# EAGLE design Mergen Telemetri + Ateşleme (EAGLE 9.6.2)
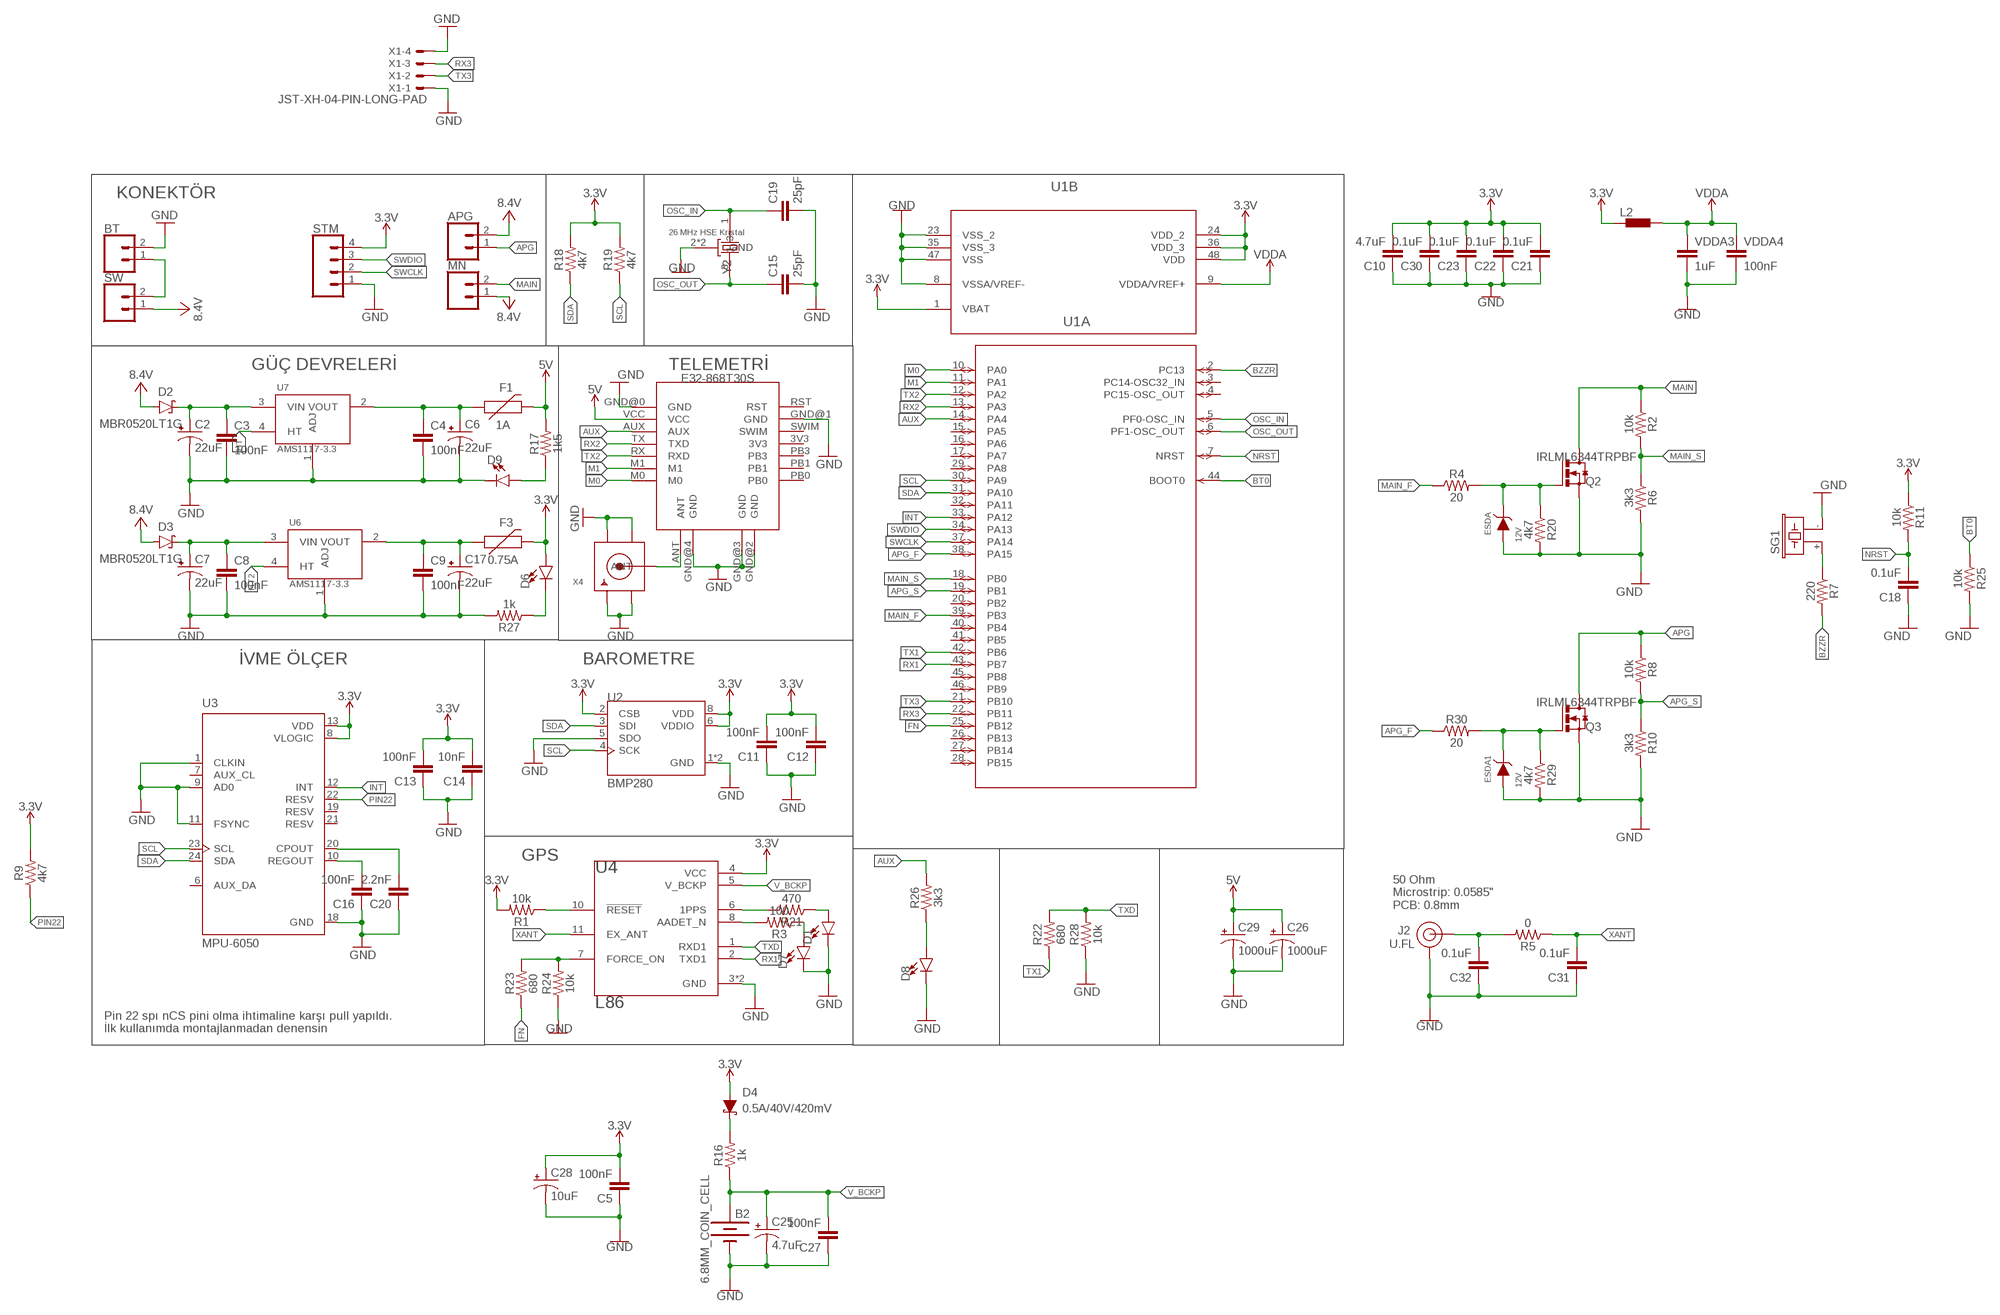
[diagram p0: schematic, sheet 1]

## Parts
APG  CONN_02POLAR  [MOLEX-1X2]
B2  6.8MM_COIN_CELL  BATTERY-6.8MM_SMD  [BATTCON-6.8MM]
BT  CONN_02POLAR  [MOLEX-1X2]
C2  22uF  47UF-POLAR-EIA3528-10V-10%  [EIA3528]
C3  100nF  1.0UF-0603-16V-10%  [0603]
C4  100nF  1.0UF-0603-16V-10%  [0603]
C5  100nF  1.0UF-0603-16V-10%  [0603]
C6  22uF  47UF-POLAR-EIA3528-10V-10%  [EIA3528]
C7  22uF  47UF-POLAR-EIA3528-10V-10%  [EIA3528]
C8  100nF  1.0UF-0603-16V-10%  [0603]
C9  100nF  1.0UF-0603-16V-10%  [0603]
C10  4.7uF  1.0UF-0603-16V-10%  [0603]
C11  100nF  1.0UF-0603-16V-10%  [0603]
C12  100nF  1.0UF-0603-16V-10%  [0603]
C13  100nF  1.0UF-0603-16V-10%  [0603]
C14  10nF  1.0UF-0603-16V-10%  [0603]
C15  25pF  1.0UF-0603-16V-10%  [0603]
C16  100nF  1.0UF-0603-16V-10%  [0603]
C17  22uF  47UF-POLAR-EIA3528-10V-10%  [EIA3528]
C18  0.1uF  1.0UF-0603-16V-10%  [0603]
C19  25pF  1.0UF-0603-16V-10%  [0603]
C20  2.2nF  1.0UF-0603-16V-10%  [0603]
C21  0.1uF  1.0UF-0603-16V-10%  [0603]
C22  0.1uF  1.0UF-0603-16V-10%  [0603]
C23  0.1uF  1.0UF-0603-16V-10%  [0603]
C25  4.7uF  47UF-POLAR-EIA3528-10V-10%  [EIA3528]
C26  1000uF  CPOL-US150CLZ-1010  [150CLZ-1010]
C27  100nF  1.0UF-0603-16V-10%  [0603]
C28  10uF  47UF-POLAR-EIA3528-10V-10%  [EIA3528]
C29  1000uF  CPOL-US150CLZ-1010  [150CLZ-1010]
C30  0.1uF  1.0UF-0603-16V-10%  [0603]
C31  0.1uF  1.0UF-0603-16V-10%  [0603]
C32  0.1uF  1.0UF-0603-16V-10%  [0603]
D1  LED0603  [LED-0603]
D2  MBR0520LT1G  SCHOTTKY_MBR0520LT1GDO-219  [SODFL3718X115]
D3  MBR0520LT1G  SCHOTTKY_MBR0520LT1GDO-219  [SODFL3718X115]
D4  0.5A/40V/420mV  DIODE-SCHOTTKY-PMEG4005EJ  [SOD-323]
D6  LED0603  [LED-0603]
D7  LED0603  [LED-0603]
D8  LED0603  [LED-0603]
D9  LED0603  [LED-0603]
ESDA  12V  WE-TVSP_DO-214AC_400W_UNI_824500102  [WE-TVSP_DO-214AC_UNIDIRECTIONAL]
ESDA1  12V  WE-TVSP_DO-214AC_400W_UNI_824500102  [WE-TVSP_DO-214AC_UNIDIRECTIONAL]
F1  1A  PPTC_HALF-AMP  [1206]
F3  0.75A  PPTC_HALF-AMP  [1206]
J2  U.FL  U.FL2PIN  [U.FL]
L2  BLM15HB221SN1  [0402]
MN  CONN_02POLAR  [MOLEX-1X2]
Q2  IRLML6344TRPBF  [SOT23]
Q3  IRLML6344TRPBF  [SOT23]
R1  10k  1KOHM-0603-1/10W-1%  [0603]
R2  10k  1KOHM-0603-1/10W-1%  [0603]
R3  100  1KOHM-0603-1/10W-1%  [0603]
R4  20  1KOHM-0603-1/10W-1%  [0603]
R5  0  1KOHM-0603-1/10W-1%  [0603]
R6  3k3  1KOHM-0603-1/10W-1%  [0603]
R7  220  1KOHM-0603-1/10W-1%  [0603]
R8  10k  1KOHM-0603-1/10W-1%  [0603]
R9  4k7  1KOHM-0603-1/10W-1%  [0603]
R10  3k3  1KOHM-0603-1/10W-1%  [0603]
R11  10k  1KOHM-0603-1/10W-1%  [0603]
R16  1k  1KOHM-0603-1/10W-1%  [0603]
R17  1k5  1KOHM-0603-1/10W-1%  [0603]
R18  4k7  1KOHM-0603-1/10W-1%  [0603]
R19  4k7  1KOHM-0603-1/10W-1%  [0603]
R20  4k7  1KOHM-0603-1/10W-1%  [0603]
R21  470  1KOHM-0603-1/10W-1%  [0603]
R22  680  1KOHM-0603-1/10W-1%  [0603]
R23  680  1KOHM-0603-1/10W-1%  [0603]
R24  10k  1KOHM-0603-1/10W-1%  [0603]
R25  10k  1KOHM-0603-1/10W-1%  [0603]
R26  3k3  1KOHM-0603-1/10W-1%  [0603]
R27  1k  1KOHM-0603-1/10W-1%  [0603]
R28  10k  1KOHM-0603-1/10W-1%  [0603]
R29  4k7  1KOHM-0603-1/10W-1%  [0603]
R30  20  1KOHM-0603-1/10W-1%  [0603]
SG1  F/CM12P  [F/CM12P]
STM  CONN_04  [1X04]
SW  CONN_02POLAR  [MOLEX-1X2]
U1  STM32F303CCT6  [LQFP48-7X7MM]
U2  BMP280  [XDCR_BMP280]
U3  MPU-6050  [QFN50P400X400X95-24N]
U4  L86  [XCVR_L86]
U5  E32-868T30S  [E32-868T30S]
U6  AMS1117-3.3  [SOT229P700X180-4N]
U7  AMS1117-3.3  [SOT229P700X180-4N]
VDDA3  1uF  0.1UF-0603-25V-(+80/-20%)  [0603]
VDDA4  100nF  0.1UF-0603-25V-(+80/-20%)  [0603]
X1  JST-XH-04-PIN-LONG-PAD  [JST-XH-04-PACKAGE-LONG-PAD]
X4  SMACONNECTOR  [SMA90_DIP]
Y2  ABM3B-26.000MHZ-10-1-U-T  [OSCCC500X320X110-4N]

## Nets
3.3V: C5.2 C10.2 C11.2 C12.2 C13.2 C14.2 C21.2 C22.2 C23.2 C28.A(+) C30.2 D4.A D6.A F3.2 L2.1 R1.2 R9.2 R11.1 R18.2 R19.2 STM.4 U1.1(B:VBAT) U1.24(B:VDD_2) U1.36(B:VDD_3) U1.48(B:VDD) U2.2(CSB) U2.6(VDDIO) U2.8(VDD) U3.8(VLOGIC) U3.13(VDD) U4.4(VCC)
5V: C26.+ C29.+ F1.2 R17.2 U5.VCC
APG: APG.1 Q3.3(D) R8.1
APG_F: R30.1 U1.38(A:PA15)
APG_S: R8.2 R10.1 U1.19(A:PB1)
AUX: R26.2 U1.14(A:PA4) U5.AUX
BT0: R25.1 U1.44(A:BOOT0)
BZZR: R7.2 U1.2(A:PC13)
FN: R23.1 U1.25(A:PB12)
GND: B2.- BT.2 C2.C(-) C3.2 C4.2 C5.1 C6.C(-) C7.C(-) C8.2 C9.2 C10.1 C11.1 C12.1 C13.1 C14.1 C15.2 C16.1 C17.C(-) C18.1 C19.2 C20.1 C21.1 C22.1 C23.1 C25.C(-) C26.- C27.1 C28.C(-) C29.- C30.1 C31.1 C32.1 D1.C D7.C D8.C D9.C ESDA1.2(A) ESDA.2(A) J2.1(GND) J2.2(GND) Q2.2(S) Q3.2(S) R6.2 R10.2 R20.2 R24.1 R25.2 R27.2 R28.1 R29.2 SG1.- STM.1 U1.8(B:VSSA/VREF-) U1.23(B:VSS_2) U1.35(B:VSS_3) U1.47(B:VSS) U2.1(GND) U2.5(SDO) U2.7(GND) U3.1(CLKIN) U3.9(AD0) U3.11(FSYNC) U3.18(GND) U4.3(GND) U4.12(GND) U5.GND@0(GND) U5.GND@1(GND) U5.GND@2(GND) U5.GND@3(GND) U5.GND@4(GND) U6.1(ADJ) U7.1(ADJ) VDDA3.2 VDDA4.2 X1.1 X1.4 X4.GND1 X4.GND2 X4.GND3 X4.GND4 Y2.2(GND) Y2.4(GND)
HT: U7.4(HT)
HT2: U6.4(HT)
INT: U1.33(A:PA12) U3.12(INT)
M0: U1.10(A:PA0) U5.M0
M1: U1.11(A:PA1) U5.M1
MAIN: MN.2 Q2.3(D) R2.1
MAIN_F: R4.1 U1.39(A:PB3)
MAIN_S: R2.2 R6.1 U1.18(A:PB0)
N$1: C2.A(+) C3.1 D2.1(C) U7.3(VIN)
N$2: C7.A(+) C8.1 D3.1(C) U6.3(VIN)
N$3: R1.1 U4.10(!RESET)
N$4: C4.1 C6.A(+) F1.1 U7.2(VOUT)
N$5: C9.1 C17.A(+) F3.1 U6.2(VOUT)
N$6: ESDA1.1(C) Q3.1(G) R29.1 R30.2
N$7: U5.ANT X4.ANTENNA(ANT)
N$8: R7.1 SG1.+
N$9: BT.1 SW.2
N$10: R21.2 U4.6(1PPS)
N$11: D1.A R21.1
N$12: D4.C R16.2
N$13: ESDA.1(C) Q2.1(G) R4.2 R20.1
N$14: D9.A R17.1
N$15: D6.C R27.1
N$16: R3.2 U4.8(AADET_N)
N$17: D7.A R3.1
N$18: C16.2 U3.10(REGOUT)
N$19: C32.2 J2.FEED(SIGNAL) R5.2
N$20: R23.2 R24.2 U4.7(FORCE_ON)
N$21: D8.A R26.1
N$22: C20.2 U3.20(CPOUT)
NRST: C18.2 R11.2 U1.7(A:NRST)
OSC_IN: C19.1 U1.5(A:PF0-OSC_IN) Y2.1
OSC_OUT: C15.1 U1.6(A:PF1-OSC_OUT) Y2.3
PIN22: R9.1 U3.22(RESV)
RX1: U1.43(A:PB7) U4.2(TXD1)
RX2: U1.13(A:PA3) U5.TX(TXD)
RX3: U1.22(A:PB11) X1.3
SCL: R19.1 U1.30(A:PA9) U2.4(SCK) U3.23(SCL)
SDA: R18.1 U1.31(A:PA10) U2.3(SDI) U3.24(SDA)
SWCLK: STM.2 U1.37(A:PA14)
SWDIO: STM.3 U1.34(A:PA13)
TX1: R22.1 U1.42(A:PB6)
TX2: U1.12(A:PA2) U5.RX(RXD)
TX3: U1.21(A:PB10) X1.2
TXD: R22.2 R28.2 U4.1(RXD1)
V_BCKP: B2.+ C25.A(+) C27.2 R16.1 U4.5(V_BCKP)
VCC: APG.2 D2.2(A) D3.2(A) MN.1 SW.1 ; supply symbol labelled 8.4V
VDDA: L2.2 U1.9(B:VDDA/VREF+) VDDA3.1 VDDA4.1
XANT: C31.2 R5.1 U4.11(EX_ANT)
Unconnected: U1.3(A:PC14-OSC32_IN) U1.4(A:PC15-OSC_OUT) U1.15(A:PA5) U1.16(A:PA6) U1.17(A:PA7) U1.20(A:PB2) U1.26(A:PB13) U1.27(A:PB14) U1.28(A:PB15) U1.29(A:PA8) U1.32(A:PA11) U1.40(A:PB4) U1.41(A:PB5) U1.45(A:PB8) U1.46(A:PB9) U3.6(AUX_DA) U3.7(AUX_CL) U3.19(RESV) U3.21(RESV) U5.3V3 U5.PB0 U5.PB1 U5.PB3 U5.RST U5.SWIM

## Notes on the sheet
- KONEKTÖR
- 26 MHz HSE Kristal
- GÜÇ DEVRELERİ | TELEMETRİ
- İVME ÖLÇER | BAROMETRE
- GPS
- 50 Ohm 
  Microstrip: 0.0585"
  PCB: 0.8mm
- Pin 22 spı nCS pini olma ihtimaline karşı pull yapıldı. 
  İlk kullanımda montajlanmadan denensin

## Library data of the parts
APG BT MN SW = SparkFun-Connectors:CONN_02: Multi connection point. Often used as Generic Header-pin footprint for 0.1 inch spaced/style header connections On any of the 0.1 inch spaced packages, you can populate with these: Break Away Headers - Straight <https://www.sparkfun.com/products/116> (PRT-00116) Break Away Male Headers - Right Angle <https://www.sparkfun.com/products/553> (PRT-00553) Female Headers <https://www.sparkfun.com/products/115> (PRT-00115) Break Away Headers - Machine Pin <https://www.sparkfun.com/products/117> (PRT-00117) Break Away Female Headers - Swiss Machine Pin <https://www.sparkfun.com/products/743> (PRT-00743) For SCREWTERMINALS and SPRING TERMINALS visit here: Screw Terimnals on SparkFun.com <https://www.sparkfun.com/search/results?term=Screw+Terminals> (5mm/3.5mm/2.54mm spacing) This device is also useful as a general connection point to wire up your design to another part of your project. Our various solder wires solder well into these plated through hole pads. Hook-Up Wire - Assortment (Stranded, 22 AWG) <https://www.sparkfun.com/products/11375> (PRT-11375) Hook-Up Wire - Assortment (Solid Core, 22 AWG) <https://www.sparkfun.com/products/11367> (PRT-11367) View the entire wire category on our website here <https://www.sparkfun.com/categories/141> Special notes: Molex polarized connector foot print use with: PRT-08233 with associated crimp pins and housings. 2.54_SCREWTERM for use with PRT-10571. 3.5mm Screw Terminal footprints for PRT-08084 5mm Screw Terminal footprints for use with PRT-08432; SF_ID: PRT-09918
B2 = SparkFun-Batteries:BATTERY: Battery - Single Cell A variety of battery chemistries, sizes, and footprints. Device List: 20MM_PTH - Coin Cell Battery Holder - 20mm (PTH) <https://www.sparkfun.com/products/783> 6.8MM_PTH - Coin Cell Battery Holder - 6.8MM(SMD) <https://www.digikey.com/product-detail/en/seiko-instruments/MS621FE-FL11E/728-1057-ND/1889208?WT.srch=1&gclid=CNOQ5a6LzdQCFZS2wAodXCkE0g> 12MM_SMD - Coin Cell Battery Holder - 12mm (SMD) <https://www.sparkfun.com/products/10592> 12MM_PTH - Coin Cell Battery Holder - 12mm (PTH) <https://www.sparkfun.com/products/7948> 20MM_SMD - 20mm Coin Cell Battery Holder (SMD) (2 legs) Used on the Big Time Watch Kit <https://www.sparkfun.com/products/11734> 20MM_SMD_4LEGS - Coin Cell Battery Holder - 20mm (SMD) <https://www.sparkfun.com/products/11892> 20MM_SMD_4LEGS_OVERPASTE - Coin Cell Battery Holder - 20mm (SMD) <https://www.sparkfun.com/products/11892> (Over-paste on the legs) 24.5MM_PTH - Coin Cell Battery Holder - 24.5mm (PTH) <https://www.sparkfun.com/products/8863> 9V - 9V Battery Holder - PC Mount Used on the SparkFun SparkPunk Sound Kit <https://www.sparkfun.com/products/11177> and SparkFun SparkPunk Sequencer Kit <https://www.sparkfun.com/products/12707> 18650 - Battery Holder - 18650 (PTH) <https://www.sparkfun.com/products/13113> AA - Battery Holder - 1xAA (PTH) <https://www.sparkfun.com/products/7949> AAA - Battery Holder - 1xAAA (PTH) <https://www.sparkfun.com/products/12718> AA_KIT - Battery Holder - 1xAA (PTH) <https://www.sparkfun.com/products/7949> Special kit package - pads only have exposed copper on one side of the board. AAA_KIT - Battery Holder - 1xAAA (PTH) <https://www.sparkfun.com/products/12718> Special kit package - pads only have exposed copper on one side of the board.; PROD_ID: BATT-13734
C2 C6 C7 C17 C25 C28 = SparkFun-Capacitors:47UF-POLAR: 47µF polarized capacitors A capacitor is a passive two-terminal electrical component used to store electrical energy temporarily in an electric field.; PROD_ID: CAP-08310; VALUE: 47uF
C3-C5 C8-C16 C18-C23 C27 C30-C32 = SparkFun-Capacitors:1.0UF: 1µF ceramic capacitors A capacitor is a passive two-terminal electrical component used to store electrical energy temporarily in an electric field.; PROD_ID: CAP-00868; VALUE: 1.0uF
C26 C29 = adafruit:CPOL-US: POLARIZED CAPACITOR, American symbol
D1 D6-D9 = SparkFun-LED:LED: LED (Generic) Standard schematic elements and footprints for 5mm, 3mm, 1206, and 0603 sized LEDs. Generic LEDs with no color specified.
D2 D3 = Diode:SCHOTTKY_: Schottky Diode - Popular parts; CATEGORY: Diode; DESCRIPTION: DIODE SCHOTTKY 20V 500MA SOD123; MANUFACTURER: ON Semiconductor; MPN: MBR0520LT1G; SUB-CATEGORY: Schottky
D4 = SparkFun-DiscreteSemi:DIODE-SCHOTTKY: Schottky diode A Schottky diode is a semiconductor diode which has a low forward voltage drop and a very fast switching action.; PROD_ID: DIO-10955
ESDA ESDA1 = Wurth_EMC Components_WE-TVSP:WE-TVSP_DO-214AC_400W_UNI: WE-TVSP Power TVS Diode Characteristics Low Profile Package Glass passivated Juction Excellent clamping capability Fast response time MSL Level 1, per J-STD-020 Classification of the plastic case: UL 94 V-0 Safety certification UL 497B, E478010 Identical design: - DO-214AC = SMAJ - DO-214AA = SMBJ - DO-214AB = SMCJ/SMDJ Applications Ideal to protect the I/O Interfaces, Bus Voltage and other circuits of sensetive electronic equipment against voltage transiensts <https://www.we-online.com/catalog/media/o55793v209%20WE-TVSP_600W-3000W_D0214AA_4C.jpg> Details see: https://www.we-online.com/catalog/en/WE-TVSP/ Updated by Ella Wu 2020-07-20 2020 (C) Würth Elektronik; DATASHEET-URL: https://www.we-online.com/catalog/datasheet/824500102.pdf; IPEAK: 2.5A; MOUNT: SMT; PART-NUMBER: 824500102; PDISS: 400W; VALUE: 100V; VBR: 117V; VCLAMP: 162V
F1 F3 = SparkFun-Fuses:PPTC: Resettable Fuse PPTC Resettable Fuse. Really a sort of resistor with a polymeric positive temperature coefficient whose resistance increases dramatically with an increase in temperature. When heated by the power passing through the resistance rises causing the current to be limited, protecting the circuit. This is achieved by the transition of the polymer from a crystalline to an amorphous state where the conductive carbon separates breaking the conductive pathways found in the cool crystalline structure. When a PPTC cools back down it resumes conducting letting the circuit turn back on. SparkFun Products: SparkFun RedBoard - Programmed with Arduino <https://www.sparkfun.com/products/12757> Pro Micro - 5V/16MHz <https://www.sparkfun.com/products/12640> Arduino Pro 328 - 5V/16MHz <https://www.sparkfun.com/products/10915> MP3 Trigger <https://www.sparkfun.com/products/13720>; PROD_ID: RES-08585; VALUE: 6V/0.5A
J2 = SparkFun-Connectors:U.FL2PIN: SMD Antenna Connector - U.FL 2mm height, 3.0mm x 3.0mm receptacle size. SparkFun Products: SparkFun WiFi Shield - ESP8266 <https://www.sparkfun.com/products/13287> SparkFun ESP8266 Thing <https://www.sparkfun.com/products/13231> SparkFun MiniGen - Pro Mini Signal Generator Shield <https://www.sparkfun.com/products/11420>; PROD_ID: CONN-09193; SF_ID: WRL-09144
L2 = inductors:BLM15H: EMIFIL (R) Chip Ferrite Bead for GHz Noise Source: http://www.murata.com/ Ferrite Bead BLM15H.pdf
Q2 Q3 = IRLML6344TRPBF (1):IRLML6344TRPBF: Transistor NMOS 30V 6.3A, 29mOhm@4.5V; AVAILABILITY: Unavailable; DESCRIPTION: RoHS Compliant | Low RDS(on) | Industry-Standard Pinout | Compatible with Existing Surface Mount Techniques | Qualified MSL1 | SOT-23 Footprint; MF: Infineon; MP: IRLML6344TRPBF; PACKAGE: SOT-23-3 International Rectifier; PRICE: None
R1-R11 R17-R26 R28-R30 = SparkFun-Resistors:1KOHM: 1kΩ resistor A resistor is a passive two-terminal electrical component that implements electrical resistance as a circuit element. Resistors act to reduce current flow, and, at the same time, act to lower voltage levels within circuits. - Wikipedia; PROD_ID: RES-07856; VALUE: 1k
R16 R27 = SparkFun-Resistors:1KOHM: 1kΩ resistor A resistor is a passive two-terminal electrical component that implements electrical resistance as a circuit element. Resistors act to reduce current flow, and, at the same time, act to lower voltage levels within circuits. - Wikipedia; PROD_ID: RES-07856
SG1 = buzzer:F/CM12P: BUZZER Source: Buerklin; OC_FARNELL: unknown; OC_NEWARK: unknown
STM = SparkFun-Connectors:CONN_04: Multi connection point. Often used as Generic Header-pin footprint for 0.1 inch spaced/style header connections On any of the 0.1 inch spaced packages, you can populate with these: Break Away Headers - Straight <https://www.sparkfun.com/products/116> (PRT-00116) Break Away Male Headers - Right Angle <https://www.sparkfun.com/products/553> (PRT-00553) Female Headers <https://www.sparkfun.com/products/115> (PRT-00115) Break Away Headers - Machine Pin <https://www.sparkfun.com/products/117> (PRT-00117) Break Away Female Headers - Swiss Machine Pin <https://www.sparkfun.com/products/743> (PRT-00743) For SCREWTERMINALS and SPRING TERMINALS visit here: Screw Terimnals on SparkFun.com <https://www.sparkfun.com/search/results?term=Screw+Terminals> (5mm/3.5mm/2.54mm spacing) This device is also useful as a general connection point to wire up your design to another part of your project. Our various solder wires solder well into these plated through hole pads. Hook-Up Wire - Assortment (Stranded, 22 AWG) <https://www.sparkfun.com/products/11375> (PRT-11375) Hook-Up Wire - Assortment (Solid Core, 22 AWG) <https://www.sparkfun.com/products/11367> (PRT-11367) View the entire wire category on our website here <https://www.sparkfun.com/categories/141> Special notes: Molex polarized connector foot print use with SKU : PRT-08231 with associated crimp pins and housings. 1MM SMD Version SKU: PRT-10208; PROD_ID: CONN-09696
U1 = STM32F303:STM32F303CCT6; BUILT_BY: EMA_UL_Team; COPYRIGHT: Copyright (C) 2018 Accelerated Designs. All rights reserved; MANUFACTURER_PART_NUMBER: STM32F303CCT6; SOURCELIBRARY: Updates_to_database_2020-10-19; VENDOR: STMicroelectronics
U2 = BMP280:BMP280: BMP280 Absolute Barometric Pressure Sensor for Battery Powered Devices 2 x 2.5mm Check prices <https://pricing.snapeda.com/parts/BMP280/Bosch/view-part?ref=eda>; AVAILABILITY: Warning; DESCRIPTION: Pressure Sensor 4.35PSI ~ 15.95PSI (30kPa ~ 110kPa) Absolute 16b 8-SMD; MF: Bosch; MP: BMP280; PACKAGE: SMD-8 Bosch Sensortec; PRICE: None; PURCHASE-URL: https://pricing.snapeda.com/search/part/BMP280/?ref=eda
U3 = MPU-6050:MPU-6050: MPU-6050 Six-Axis (Gyro + Accelerometer) MEMS MotionTracking™ Devices Check prices <https://pricing.snapeda.com/parts/MPU-6050/TDK%20InvenSense/view-part?ref=eda>; AVAILABILITY: Warning; DESCRIPTION: Accelerometer, Gyroscope, 6 Axis Sensor I²C Output; MF: TDK InvenSense; MP: MPU-6050; PACKAGE: QFN-24 InvenSense; PRICE: None; PURCHASE-URL: https://pricing.snapeda.com/search/part/MPU-6050/?ref=eda
U4 = L86:L86: L86 is an ultra-compact GNSS POT (Patch on Top) module with an embedded 18.4mm × 18.4mm × 4.0mm patch antenna and utilizes the MediaTek new generation GNSS chipset MT3333 that achieves the perfect performance; AVAILABILITY: Unavailable; DESCRIPTION: L86 is an ultra-compact GNSS POT (Patch on Top) module with an embedded 18.4mm × 18.4mm × 4.0mm patch antenna and utilizes the MediaTek new generation GNSS chipset MT3333 that achieves the perfect performance; MF: Quectel; MP: L86; PACKAGE: PowerSFN-8 Quectel; PRICE: None
U5 = E32-868T30S:E32-868T30S: E BYTE E32-868T30S
U6 U7 = AMS1117-3.3:AMS1117-3.3: Sot223/Pkg 1-Amp 3.3-Volt Low Drop Out Voltage Regulatator; AVAILABILITY: Unavailable; DESCRIPTION: Sot223/Pkg 1-Amp 3.3-Volt Low Drop Out Voltage Regulatator; MF: Advanced Monolithic Systems; MP: AMS1117-3.3; PACKAGE: SOT-89 ams; PRICE: None
VDDA3 VDDA4 = SparkFun-Capacitors:0.1UF: 0.1µF ceramic capacitors A capacitor is a passive two-terminal electrical component used to store electrical energy temporarily in an electric field.; PROD_ID: CAP-00810; VALUE: 0.1uF
X1 = Rembrandt Electronics - JST XH Connectors v1-0:JST-XH-04-PIN: JST XH Connector 2 Pin Wire to board connector. Pitch: 2,54 mm, (0.100") Number of pins: 4 Created by Rembrandt Electronics www.rembrandtelectronics.com
X4 = adafruit:SMACONNECTOR: SMA Connector 90° DIP SMA Connector, 50 Ohm (4UConnector: 07259)
Y2 = ABM3B-26.000MHZ-10-1-U-T:ABM3B-26.000MHZ-10-1-U-T: Ceramic SMD Crystal Check prices <https://pricing.snapeda.com/parts/ABM3B-26.000MHZ-10-1-U-T/Abracon/view-part?ref=eda>; AVAILABILITY: Good; DESCRIPTION: 26MHz ±10ppm Crystal 10pF 50 Ohms 4-SMD, No Lead; MF: Abracon; MP: ABM3B-26.000MHZ-10-1-U-T; PACKAGE: SMD-4 Abracon LLC; PRICE: None; PURCHASE-URL: https://pricing.snapeda.com/search/part/ABM3B-26.000MHZ-10-1-U-T/?ref=eda

## Net classes
1 Power: width 0.305 mm

## Board
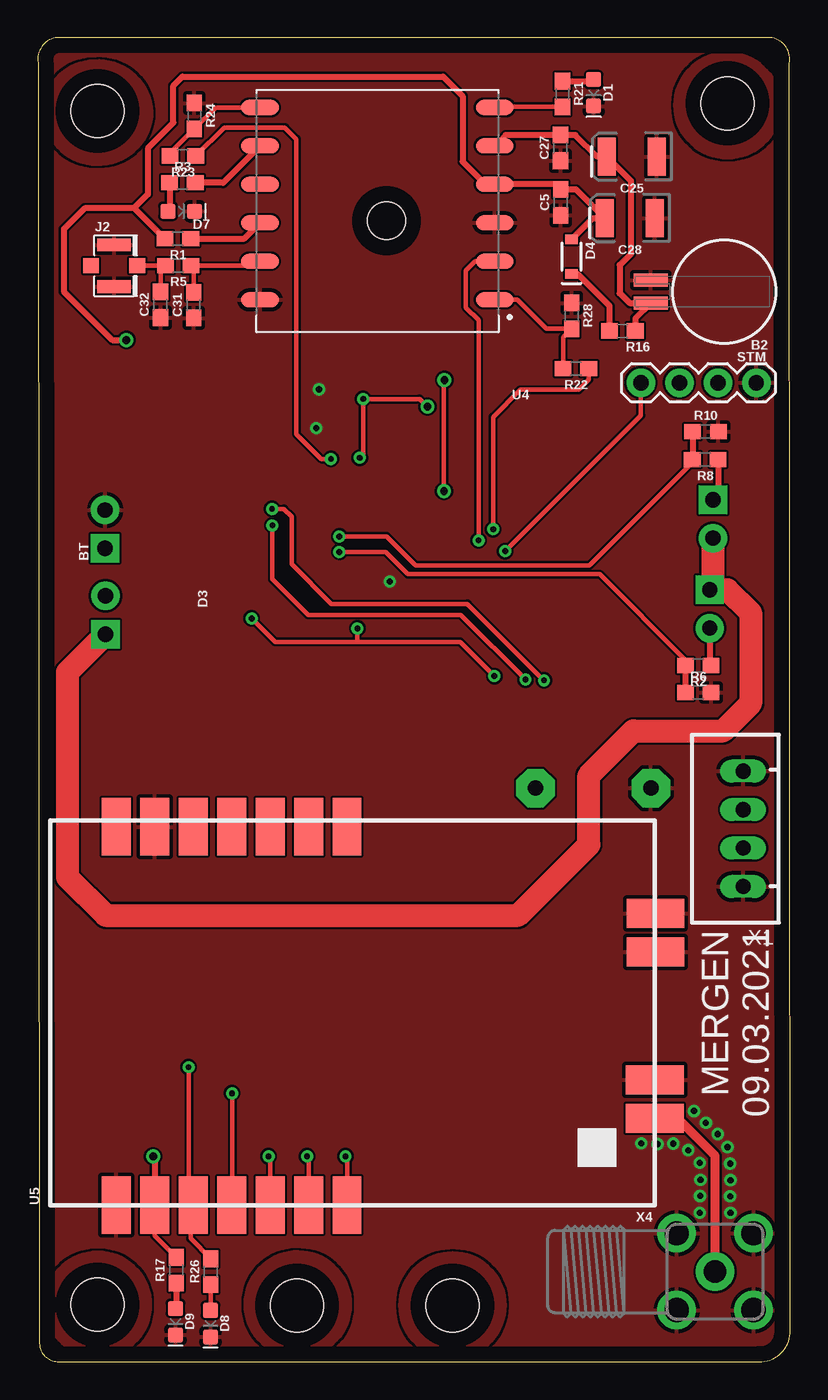
[diagram p1: board, top side]
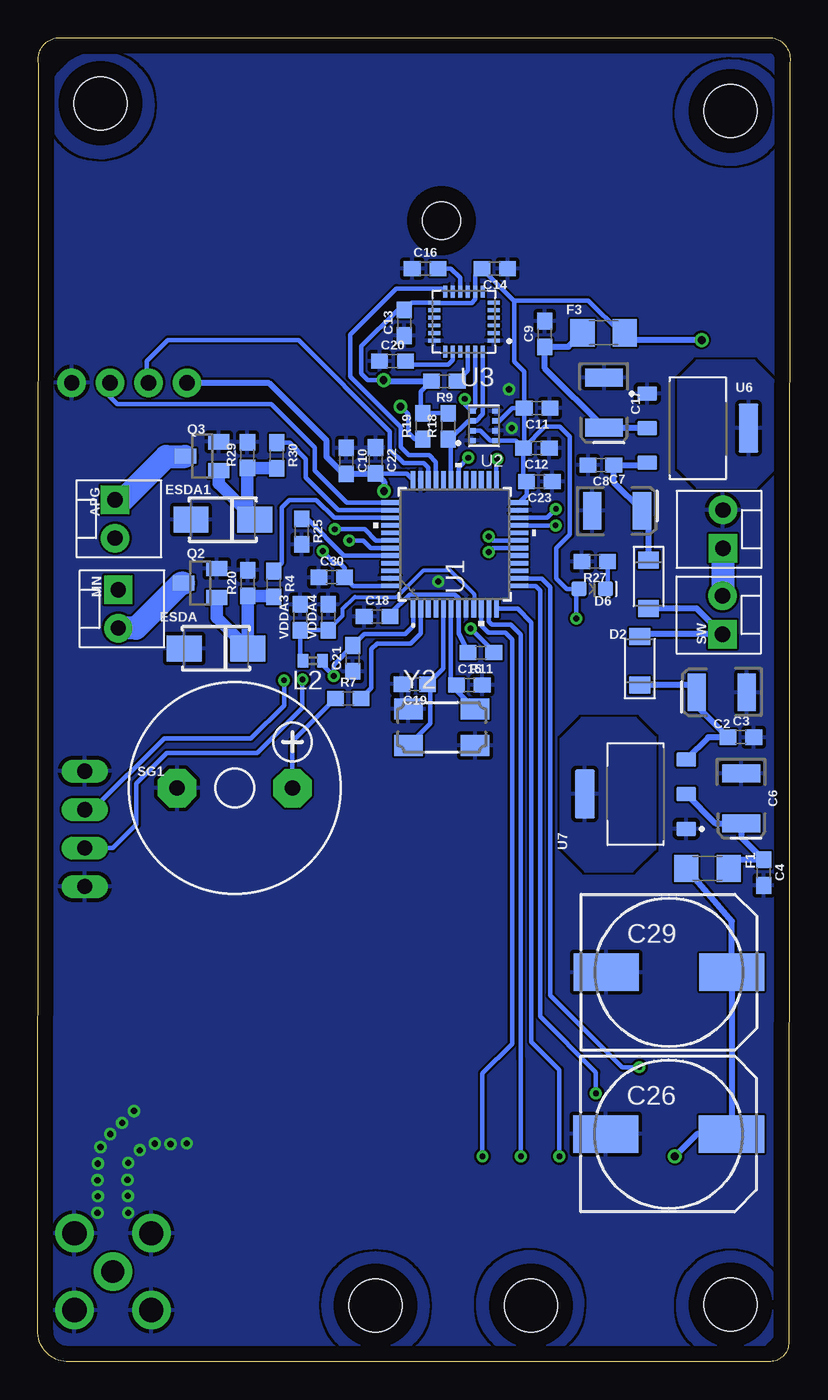
[diagram p2: board, bottom side, seen from below]

Size 49.68 x 87.45 mm. Coordinates in mm from the lower left corner, seen from the top.
Outline: 0.02,85.81 0.1,1.3 arc90 1.3,0 47.62,0 arc90 49.68,1.88 49.63,85.75 arc90 48.49,87.45 1.16,87.45 arc90 0.02,85.81
Copper layers (1*16): Top 0.035mm / dielectric 1.5mm / Bottom 0.035mm
Design rules "default": minimum track width 6mil, minimum drill 0.35mm, track to track 6mil, track to pad 6mil, pad to pad 6mil, via to via 6mil, smd to smd 6mil, copper to edge 40mil, drill to drill 6mil, minimum pad ring 10mil, minimum via ring 8mil, stop-mask expansion 4mil, vias tented up to drill 0mil, thermal gap 10mil
Holes 3.5 mm at 3.93,82.63 45.54,83.13 27.38,3.71 3.93,3.76 17.12,3.71
Holes 2.5 mm at 23.02,75.38

### Footprints (pad centres in the part's own frame; a part is rotated, then mirrored left to right if it is on the bottom)
MOLEX-1X2 = drill 1.016 pad 1.88 square: 1 0,0 | drill 1.016 pad 1.88: 2 2.54,0
BATTCON-6.8MM = smd 2.25 x 0.85: + 4.87,0.75; - 4.87,-0.75
EIA3528 = smd 1.2 x 2.5: A 1.65,0; C -1.65,0
0603 = smd 1.1 x 1: 1 -0.85,0; 2 0.85,0
150CLZ-1010 = smd 4.3 x 2.5: + 4.15,0; - -4.15,0
LED-0603 = smd 1 x 1: A -0.877,0; C 0.877,0
SODFL3718X115 = smd 1.115 x 1.361: 1 -1.6,0; 2 1.6,0
SOD-323 = smd 0.63 x 0.83: A 1.15,0; C -1.15,0
WE-TVSP_DO-214AC_UNIDIRECTIONAL = smd 2.3 x 1.7: 1 -2.1,0; 2 2.1,0
1206 = smd 1.6 x 1.8: 1 -1.4,0; 2 1.4,0
U.FL = smd 2.2 x 0.85: 1 0,1.375; 2 0,-1.375 | smd 1.05 x 1: FEED 1.525,0; NC -1.525,0
0402 = smd 0.7 x 0.9: 1 -0.65,0; 2 0.65,0
SOT23 = smd 1 x 1.4: 1 -0.95,-1.1; 2 0.95,-1.1; 3 0,1.1
F/CM12P = drill 1.016 pad 2.54 octagon: + 3.81,0; - -3.81,0
1X04 = drill 1.016 pad 1.88: 1 0,0; 2 2.54,0; 3 5.08,0; 4 7.62,0
LQFP48-7X7MM = smd 1.194 x 0.305: 1 -4.25,2.75; 2 -4.25,2.25; 3 -4.25,1.75; 4 -4.25,1.25; 5 -4.25,0.75; 6 -4.25,0.25; 7 -4.25,-0.25; 8 -4.25,-0.75; 9 -4.25,-1.25; 10 -4.25,-1.75; 11 -4.25,-2.25; 12 -4.25,-2.75; 25 4.25,-2.75; 26 4.25,-2.25; 27 4.25,-1.75; 28 4.25,-1.25; 29 4.25,-0.75; 30 4.25,-0.25; 31 4.25,0.25; 32 4.25,0.75; 33 4.25,1.25; 34 4.25,1.75; 35 4.25,2.25; 36 4.25,2.75 | smd 0.305 x 1.194: 13 -2.75,-4.25; 14 -2.25,-4.25; 15 -1.75,-4.25; 16 -1.25,-4.25; 17 -0.75,-4.25; 18 -0.25,-4.25; 19 0.25,-4.25; 20 0.75,-4.25; 21 1.25,-4.25; 22 1.75,-4.25; 23 2.25,-4.25; 24 2.75,-4.25; 37 2.75,4.25; 38 2.25,4.25; 39 1.75,4.25; 40 1.25,4.25; 41 0.75,4.25; 42 0.25,4.25; 43 -0.25,4.25; 44 -0.75,4.25; 45 -1.25,4.25; 46 -1.75,4.25; 47 -2.25,4.25; 48 -2.75,4.25
XDCR_BMP280 = smd 0.5 x 0.35: 1 0.8,0.975; 2 0.8,0.325; 3 0.8,-0.325; 4 0.8,-0.975; 5 -0.8,-0.975; 6 -0.8,-0.325; 7 -0.8,0.325; 8 -0.8,0.975
QFN50P400X400X95-24N = smd 0.79 x 0.26: 1 -1.97,1.25; 2 -1.97,0.75; 3 -1.97,0.25; 4 -1.97,-0.25; 5 -1.97,-0.75; 6 -1.97,-1.25; 13 1.97,-1.25; 14 1.97,-0.75; 15 1.97,-0.25; 16 1.97,0.25; 17 1.97,0.75; 18 1.97,1.25 | smd 0.26 x 0.79: 7 -1.25,-1.97; 8 -0.75,-1.97; 9 -0.25,-1.97; 10 0.25,-1.97; 11 0.75,-1.97; 12 1.25,-1.97; 19 1.25,1.97; 20 0.75,1.97; 21 0.25,1.97; 22 -0.25,1.97; 23 -0.75,1.97; 24 -1.25,1.97
XCVR_L86 = smd 2.5 x 1: 1 -7.75,6.35; 2 -7.75,3.81; 3 -7.75,1.27; 4 -7.75,-1.27; 5 -7.75,-3.81; 6 -7.75,-6.35; 7 7.75,-6.35; 8 7.75,-3.81; 9 7.75,-1.27; 10 7.75,1.27; 11 7.75,3.81; 12 7.75,6.35
E32-868T30S = smd 3.81 x 1.905: 3V3 12.3,5.08; AUX -12.7,7.62; GND@0 -12.7,12.7; GND@1 12.3,10.16; M0 -12.7,-2.54; M1 -12.7,0; PB0 12.3,-2.54; PB1 12.3,0; PB3 12.3,2.54; RST 12.3,12.7; RX -12.7,2.54; SWIM 12.3,7.62; TX -12.7,5.08; VCC -12.7,10.16 | smd 1.905 x 3.81: ANT -6.97,-22.86; GND@2 6.57,-22.91; GND@3 4.03,-22.91; GND@4 -4.43,-22.86
SOT229P700X180-4N = smd 0.93 x 1.31: 1 -2.29,-3.345; 2 0,-3.345; 3 2.29,-3.345 | smd 3.24 x 1.31: 4 0,3.345
JST-XH-04-PACKAGE-LONG-PAD = drill 1.016 long: 1 -3.81,0; 2 -1.27,0; 3 1.27,0; 4 3.81,0
SMA90_DIP = drill 1.5 pad 2.54: ANTENNA 0,0 | drill 1.6 pad 2.54: GND1 -2.54,2.54; GND2 2.54,2.54; GND3 -2.54,-2.54; GND4 2.54,-2.54
OSCCC500X320X110-4N = smd 1.9 x 1.4: 1 -2.2,-1.2; 2 2.2,-1.2; 3 2.2,1.2; 4 -2.2,1.2

### Placement (x,y rotation side)
APG  44.57,56.95 270 bottom
B2  45.34,70.69 180 top
BT  4.44,53.72 90 bottom
C2  4.52,44.22 180 bottom
C3  3.25,41.25 0 bottom
C4  1.75,32.31 270 bottom
C5  34.54,76.58 90 top
C6  3.22,37.21 270 bottom
C7  11.43,56.21 0 bottom
C8  12.49,59.23 180 bottom
C9  16.2,67.89 90 bottom
C10  29.31,59.51 270 bottom
C11  16.71,62.99 180 bottom
C12  16.76,60.35 180 bottom
C13  25.47,68.63 90 bottom
C14  19.5,72.21 180 bottom
C15  21.18,44.7 0 bottom
C16  24.1,72.21 0 bottom
C17  12.29,63.35 270 bottom
C18  27.28,49.23 0 bottom
C19  24.79,44.75 180 bottom
C20  26.26,66.09 0 bottom
C21  28.88,46.46 90 bottom
C22  27.38,59.54 270 bottom
C23  16.56,58.14 180 bottom
C25  39.21,79.6 180 top
C26  8.02,15.04 0 bottom
C27  34.52,80.19 90 top
C28  39.09,75.54 180 top
C29  8,25.73 0 bottom
C30  30.27,51.82 0 bottom
C31  10.28,69.8 90 top
C32  8.1,69.82 90 top
D1  36.7,83.82 270 top
D2  9.93,46.3 90 bottom
D3  9.34,51.36 270 bottom
D4  35.25,73 90 top
D6  13.08,51.05 0 bottom
D7  9.47,76 0 top
D8  11.4,2.51 270 top
D9  9.09,2.64 270 top
ESDA  37.92,47.12 180 bottom
ESDA1  37.46,55.63 180 bottom
F1  5.46,32.59 180 bottom
F3  12.32,67.97 0 bottom
J2  5.04,72.4 0 top
L2  31.52,46.3 180 bottom
MN  44.37,51 270 bottom
Q2  38.96,51.44 90 bottom
Q3  38.83,59.82 90 bottom
R1  9.24,74.19 180 top
R2  43.61,46 180 top
R3  9.55,77.88 0 top
R4  34.11,51.38 270 bottom
R5  9.27,72.42 180 top
R6  43.61,44.2 0 top
R7  29.18,43.81 0 bottom
R8  44.07,59.59 180 top
R9  22.83,64.77 180 bottom
R10  44.09,61.44 0 top
R11  20.42,46.84 180 bottom
R16  38.61,68.1 180 top
R17  9.14,6.05 90 top
R18  22.58,61.8 90 bottom
R19  24.25,61.8 90 bottom
R20  35.81,51.44 90 bottom
R21  34.64,83.74 270 top
R22  35.53,65.61 180 top
R23  9.57,79.65 180 top
R24  10.33,82.3 270 top
R25  32.26,54.84 270 bottom
R26  11.43,5.94 90 top
R27  12.9,52.86 180 bottom
R28  35.25,69.09 270 top
R29  35.84,59.89 90 bottom
R30  33.91,59.87 270 bottom
SG1  36.67,37.9 0 bottom
STM  47.44,64.67 180 top
SW  4.47,48.06 90 bottom
U1  22.15,54 90 bottom
U2  20.22,61.82 180 bottom
U3  21.54,68.71 180 bottom
U4  22.43,76.5 180 top
U5  17.88,23.04 90 top
U6  6.09,61.67 270 bottom
U7  10.21,37.49 90 bottom
VDDA3  32.36,49.17 90 bottom
VDDA4  30.5,49.17 90 bottom
X1  46.58,35.2 90 top
X4  44.73,5.94 90 top
Y2  23.01,41.91 0 bottom

### Tracks (layer width: path | path; a pad name or v marks a point on that pad's centre or on a via)
3.3V  (via drill 0.38, 0.51)
  Top 0.305: v30.86,53.54 39.82,62.51 STM.4 | v30.15,45.29 27.89,47.55 21.1,47.55 | v26.84,64.85 26.82,64.82 v26.82,57.51 | v14.12,49.1 15.67,47.55 21.1,47.55 | 21.1,47.55 v21.1,48.44
  Top 0.381: v5.84,67.49 4.92,67.49 1.72,70.69 1.72,74.83 3.1,76.2 6.35,76.2 6.37,76.23 7.26,77.11 7.26,80.16 8.95,81.86 8.95,84.29 9.55,84.89 26.77,84.89 28.05,83.61 28.05,79.27 29.55,77.77 U4.4 34.2,77.77 C5.2 35.55,77.43 C28.A 36.64,75.54 D4.A
  Top 0.406: 6.37,76.23 6.37,76.21 R1.2
  Bottom 0.305: U2.2 21,61.51 20.46,61.51 19.8,60.85 U2.8 18.11,60.85 C12.2 | U1.1 24.9,48.58 25.42,48.06 28.13,48.06 C21.2 30.15,46.04 v30.15,45.29 30.87,46.01 L2.1 | U2.6 19.2,62.15 18.36,62.99 C11.2 | v26.84,64.85 27.89,64.85 28.32,65.28 28.32,67.08 25.92,69.48 C13.2 25,69.96 U3.13 23.49,69.94 21.03,69.94 20.79,70.18 U3.8 20.79,71.78 C14.2 18.25,70.1 18.22,70.1 | 18.22,70.1 18.22,66.06 17.56,65.39 C11.2 | F3.2 11.2,67.97 13.33,70.1 18.22,70.1 | C11.2 17.56,60.4 | 17.56,60.4 C12.2 | U1.36 25.31,58.66 27.4,58.66 | 17.56,60.4 16.19,61.77 15.21,61.77 14.55,61.11 14.55,54.64 15.44,53.75 15.44,51.74 14.75,51.05 D6.A 14.12,50.89 v14.12,49.1 | U1.24 17.41,57.24 C23.2 17.61,58.34 C12.2 | U1.48 28.86,51.25 C30.2 29.42,52.44 29.71,52.73 30.07,52.73 30.86,53.52 v30.86,53.54 | R18.2 R19.2 24.38,62.78 24.38,64.07 R9.2 | v21.1,48.44 19.57,46.9 R11.1
  Bottom 0.381: v5.84,67.49 10.43,67.49 F3.2
  Bottom 0.406: STM.4 39.8,64.64 34.41,64.64 30.6,60.83 30.6,59.77 29.5,58.66 C10.2 27.4,58.66 C22.2 26.82,58.13 v26.82,57.51 | v26.84,64.85 26.77,64.77 R9.2
5V  (via drill 0.51)
  Top 0.305: U5.VCC 7.72,8.32 R17.2
  Top 0.406: v7.62,13.56 7.72,13.46 U5.VCC
  Bottom 0.381: C29.+ 3.85,29.1 F1.2
  Bottom 0.406: C29.+ 3.85,15.06 C26.+ 6.14,15.04 v7.62,13.56
APG
  Top 0.305: APG.1
  Top 0.406: R8.1 44.92,57.29 APG.1
  Bottom 0.813: Q3.3 39.96,59.79
  Bottom 1.524: 39.96,59.79 41.21,59.79 44.05,56.95 APG.1
APG_F
  Bottom 0.305: U1.38 29.83,56.25 31.98,58.39 31.98,59.64 33.05,60.72 R30.1
APG_S  (via drill 0.38)
  Top 0.305: v19.91,54.51 23.03,54.51 24.94,52.6 36.43,52.6 43.22,59.39 R8.2
  Top 0.406: R10.1 43.24,59.61 R8.2
  Bottom 0.305: v19.91,54.51 19.65,54.25 U1.19
AUX  (via drill 0.38)
  Top 0.305: R26.2 10.08,8.14 10.08,8.56 10.26,8.74 U5.AUX 10.21,10.39 10.21,9.8 9.95,10.06 v9.95,19.46
  Bottom 0.305: v9.95,19.46 11.1,19.46 15.85,24.21 15.85,51.18 16.42,51.75 U1.14
BT0
  Bottom 0.305: U1.44 29.46,53.25 31.9,55.69 R25.1
BZZR
  Bottom 0.305: U1.2 24.4,48.12 25.07,47.45 27.28,47.45 27.66,47.07 27.66,44.49 R7.2
D
  pour Top: 0.4,82.55 arc-90 3.71,85.95 arc-90 7.57,82.58 arc-90 3.88,79.07 arc-90
  pour Top: 42.03,83.01 arc-90 45.56,86.49 arc-90 49.04,82.96 arc-90 45.54,79.5 arc-90
  pour Top: 0.45,3.76 arc-90 3.96,7.26 arc-90 7.46,3.73 arc-90 3.96,0.25 arc-90
  pour Top: 13.66,3.78 arc-90 17.19,7.29 arc-90 20.67,3.76 arc-90 17.17,0.28 arc-90
  pour Top: 23.87,3.73 arc-90 27.4,7.21 arc-90 30.88,3.73 arc-90 27.35,0.2 arc-90
  pour Bottom: 49.04,83.01 arc90 45.51,86.49 arc90 42.03,83.01 arc90 45.62,79.5 arc90
  pour Bottom: 7.57,82.58 arc90 3.71,85.95 arc90 0.4,82.55 arc90 3.88,79.07 3.93,79.07 arc90
  pour Bottom: 7.46,3.73 arc90 3.93,7.26 arc90 0.45,3.76 arc90 4.04,0.25 arc90
  pour Bottom: 20.67,3.84 arc90 17.19,7.29 arc90 13.66,3.76 arc90 17.19,0.28 arc90
  pour Bottom: 30.88,3.73 arc90 27.4,7.21 27.38,7.21 arc90 23.87,3.68 arc90 27.35,0.2 arc90
FN  (via drill 0.38)
  Top 0.305: v19.35,59.64 18.72,59.64 17.07,61.29 17.07,80.77 16.31,81.53 12.29,81.53 R23.1
  Bottom 0.305: v19.35,59.64 19.4,59.6 U1.25
GND  (via drill 0.38, 0.41)
  other vias: 39.85,14.43 40.92,14.38 41.96,14.4 42.95,13.97 43.71,13.13 43.76,12.01 43.74,10.95 43.71,9.83 45.74,9.83 45.72,10.92 45.74,11.99 45.72,13.08 45.54,14.17 44.9,15.04 44.12,15.77 43.33,16.56 18.39,61.67 18.56,64.24 23.24,51.54
  pour Bottom (rank 2): -0.38,87.63 -0.38,-0.63 50.04,-0.63 50.04,87.63
  pour Top (rank 2): -0.87,88.14 -0.87,-1.07 50.29,-1.07 50.29,88.14
HT
  pour Bottom: 8.91,41.25 8.91,33.88 10.41,32.39 13.54,32.39 15.16,34.01 15.16,41.12 13.76,42.52 10.18,42.52
HT2
  pour Bottom: 0.96,64.72 2.38,66.14 6.17,66.14 7.39,64.92 7.39,59.03 6.12,57.76 2.23,57.76 0.96,59.03
INT
  Bottom 0.305: U3.12 23,70.89 26.01,70.89 29.05,67.84 29.05,65.06 25.73,61.73 25.73,60.43 25.19,59.89 23.85,59.89 23.4,59.44 U1.33
M0  (via drill 0.38)
  Top 0.305: v20.32,13.56 20.42,13.46 U5.M0
  Bottom 0.305: U1.10 20.4,48.62 19.94,48.16 18.82,48.16 18.36,47.7 18.36,21.01 20.32,19.05 v20.32,13.56
M1  (via drill 0.38)
  Top 0.305: v17.78,13.56 17.88,13.46 U5.M1
  Bottom 0.305: U1.11 19.9,48.88 19.71,48.69 18.46,48.69 17.8,48.03 17.8,20.02 17.78,19.99 v17.78,13.56
MAIN
  Top 0.406: MN.2 44.37,46.09 R2.1
  Bottom 1.524: Q2.3 40.21,51.44 43.18,48.46 MN.2
MAIN_F
  Bottom 0.305: U1.39 30.12,55.75 31.29,56.92 33.07,56.92 33.58,56.41 33.58,52.77 R4.1
MAIN_S  (via drill 0.38)
  Top 0.305: v19.91,53.49 22.96,53.49 24.43,52.02 37.11,52.02 42.76,46.37 R2.2
  Top 0.406: R2.2 R6.1
  Bottom 0.305: v19.91,53.49 19.65,53.75 U1.18
N$1
  Bottom 0.381: U7.3 6.86,39.81 5.42,41.25 C3.1 6.17,43.32 C2.A 6.65,44.7 D2.1
N$2
  Bottom 0.381: D3.1 9.34,55.78 C7.A 11.64,58.08 C8.1 9.64,59.23 9.47,59.41 U6.3
N$3
  Top 0.406: R1.1 13.63,74.19 U4.10
N$4
  Bottom 0.381: U7.2 4.93,35.56 C6.A 3.22,34.63 C4.1 3.49,33.16 F1.1
N$5
  Bottom 0.381: U6.2 12.26,61.67 C17.A 16.2,65.61 C9.1 14.64,67.04 F3.1
N$6
  Bottom 0.813: Q3.1 37.73,58 ESDA1.1 35.84,56.1 R29.1 35.81,59.02 R30.2
N$7
  Top 0.61: X4.ANTENNA 44.73,13.6 42.25,16.07 U5.ANT
N$8
  Bottom 0.305: R7.1 32.86,40.98 SG1.+
N$9
  Bottom 1.524: BT.1 4.44,50.62 SW.2
N$10
  Top 0.305: R21.2 30.21,82.89 U4.6
N$11
  Top 0.406: R21.1 36.6,84.59 D1.A
N$12
  Top 0.381: R16.2 37.75,69.73 35.64,71.85 D4.C
N$13
  Bottom 0.813: Q2.1 37.86,49.16 ESDA.1 R20.1 34.16,50.59 R4.2
N$14
  Top 0.381: R17.1 9.14,3.57 D9.A
N$15
  Bottom 0.305: D6.C 12.05,51.2 R27.1
N$16
  Top 0.406: U4.8 12.24,77.88 R3.2
N$17
  Top 0.406: R3.1 8.7,76.1 D7.A
N$18
  Bottom 0.305: U3.10 21.79,71.6 22.4,72.21 C16.2
N$19
  Top 0.305: C32.2 8.1,72.1 R5.2 8.4,72.4 J2.FEED
N$20
  Top 0.305: R23.2 8.72,79.83 R24.2 11.74,82.85 U4.7
N$21
  Top 0.305: R26.1 11.43,3.42 D8.A
N$22
  Bottom 0.305: U3.20 22.29,66.16 22.59,65.86 25.18,65.86 C20.2
NRST
  Bottom 0.305: C18.2 26.43,49.4 25.13,50.69 22.14,50.69 21.9,50.45 U1.7 21.9,48.15 R11.2
OSC_IN
  Bottom 0.305: Y2.1 23.77,42.15 23.77,44.59 C19.1 22.9,45.8 U1.5
OSC_OUT
  Bottom 0.305: U1.6 22.4,46.05 22.4,45.07 | 22.4,45.07 22.4,44.7 Y2.3 22.03,44.33 C15.1 22.4,45.07
PIN22
  Bottom 0.305: R9.1 21.29,65.47 U3.22
RX1  (via drill 0.38)
  Top 0.305: v29.11,54.25 29.11,68.81 28.27,69.65 28.27,72.09 28.88,72.69 U4.2
  Bottom 0.305: U1.43 27.69,53.75 28.19,54.25 v29.11,54.25
RX2  (via drill 0.38)
  Top 0.305: v12.82,17.73 12.82,10.36 U5.TX
  Bottom 0.305: U1.13 16.8,51.25 16.49,50.94 16.49,22.8 12.82,19.13 v12.82,17.73
RX3  (via drill 0.38)
  Top 0.305: v33.42,45.01 28.37,50.06 19.38,50.06 16.76,52.68 16.76,55.83 16.25,56.34 v15.47,56.34
  Bottom 0.305: v33.42,45.01 33.42,43.36 35.61,41.17 41.35,41.17 46.05,36.47 X1.3 | v15.47,56.34 16.05,55.75 U1.22
SCL  (via drill 0.38, 0.51)
  Top 0.305: v21.26,59.72 21.49,59.94 v21.49,63.6 25.22,63.6 v25.73,63.09
  Bottom 0.305: U3.23 20.79,63.03 U2.4 21.49,63.27 v21.49,63.6 | v21.26,59.72 21.9,59.08 U1.30 | v25.73,63.09 25.22,62.59 25.22,61.37 24.8,60.95 R19.1
SDA
  Bottom 0.305: U3.24 20.29,62.59 20.73,62.15 U2.3 21.25,62.15 22.5,60.9 | R18.1 22.56,60.97 22.5,60.9 | 22.5,60.9 22.4,60.8 U1.31
SWCLK
  Bottom 0.305: U1.37 29.26,56.75 31.39,58.88 31.39,60.38 34.27,63.26 44.43,63.26 44.95,63.78 44.95,64.62 STM.2
SWDIO
  Bottom 0.305: U1.34 23.9,59.05 24.2,59.36 25.52,59.36 26.42,60.26 26.42,61.45 32.46,67.49 41.09,67.49 42.49,66.09 42.49,64.8 STM.3
TX1  (via drill 0.38)
  Top 0.305: v30.07,54.99 30.07,62.41 31.87,64.21 35.71,64.21 36.38,64.88 R22.1
  Bottom 0.305: U1.42 27.35,54.25 28.09,54.99 v30.07,54.99
TX2  (via drill 0.38)
  Top 0.305: v15.24,13.56 15.34,13.46 U5.RX
  Bottom 0.305: U1.12 18,49.75 17.09,48.84 17.09,21.13 15.24,19.28 v15.24,13.56
TX3  (via drill 0.38)
  Top 0.305: v32.2,45.06 27.94,49.33 17.85,49.33 15.49,51.69 v15.49,55.25
  Bottom 0.305: v32.2,45.06 32.2,43.18 35.18,40.21 41.18,40.21 43.18,38.21 43.18,35.48 44.73,33.93 X1.2 | v15.49,55.25 U1.21
TXD
  Top 0.305: R22.2 34.68,67.67 R28.2 33.59,68.24 31.67,70.15 U4.1
V_BCKP
  Top 0.381: R16.1 39.45,68.93 B2.+ 39.08,69.94 38.43,70.59 38.43,72.44 39.16,73.18 39.16,78 C25.A 36.93,79.6 35.49,81.04 C27.2 30.9,81.04 U4.5
VCC
  Top 1.016: MN.1 44.57,51.21
  Top 1.524: MN.1 45.54,51 47.06,49.48 47.06,43.48 45.25,41.67 39.33,41.67 36.38,38.72 36.38,34.15 31.72,29.49 4.47,29.49 1.95,32 1.95,45.54 SW.1 | APG.2 44.57,51.21
  Bottom 0.381: D3.2 6.17,49.76 SW.1 9.78,48.06 D2.2
VDDA
  Bottom 0.254: VDDA4.1 29.56,49.26 29.56,49.71 28.75,50.52 25.96,50.52 24.19,52.29 22.47,52.29 20.88,50.7 20.88,49.77 U1.9
  Bottom 0.305: VDDA4.1 VDDA3.1 32.36,46.49 L2.2
XANT
  Top 0.305: C31.2 10.28,72.25 R5.1 14.4,72.42 U4.11

### Text on the board
tPlace: MERGEN / 09.03.2021